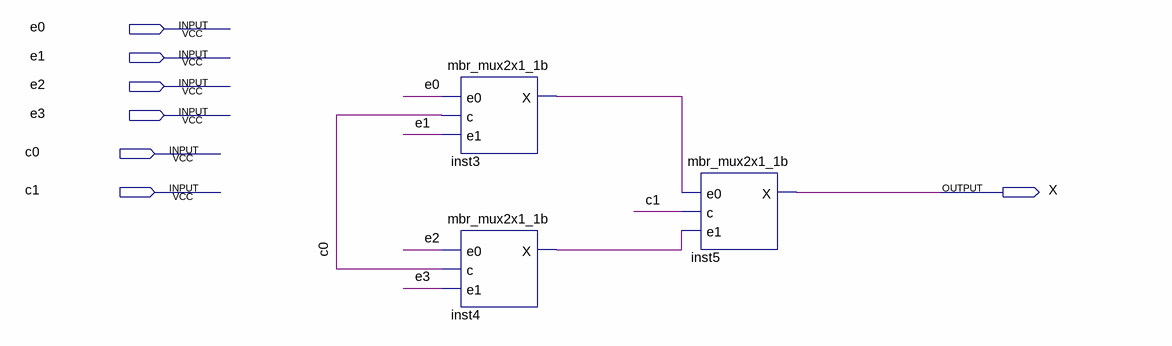
[diagram p0: schematic sheet]
// Quartus schematic mbr_mux4x1_1b.bdf as structural Verilog: 3 symbols, 7 pins
module mbr_mux4x1_1b (
  input  e0,
  input  e1,
  input  e2,
  input  e3,
  input  c0,
  input  c1,
  output X
);

  wire inst3_x, inst4_x;

  mbr_mux2x1_1b inst3 (.e0(e0), .c(c0), .e1(e1), .X(inst3_x));
  mbr_mux2x1_1b inst4 (.e0(e2), .c(c0), .e1(e3), .X(inst4_x));
  mbr_mux2x1_1b inst5 (.e0(inst3_x), .c(c1), .e1(inst4_x), .X(X));
endmodule
